# EAGLE schematic untitled (EAGLE 7.6.0)
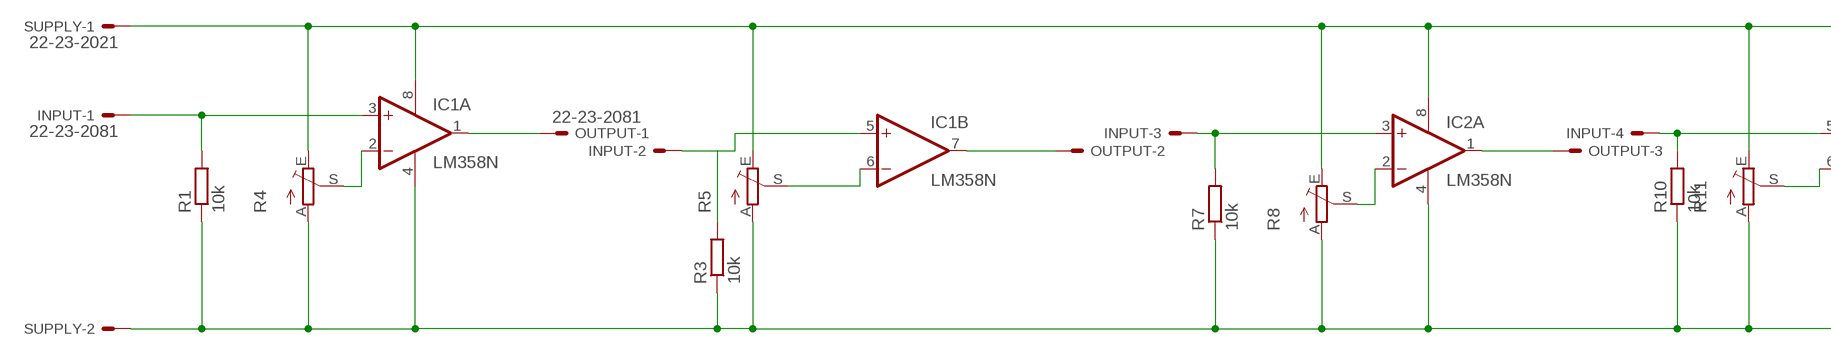
[diagram p0: schematic, sheet 1, part 1 of 2]
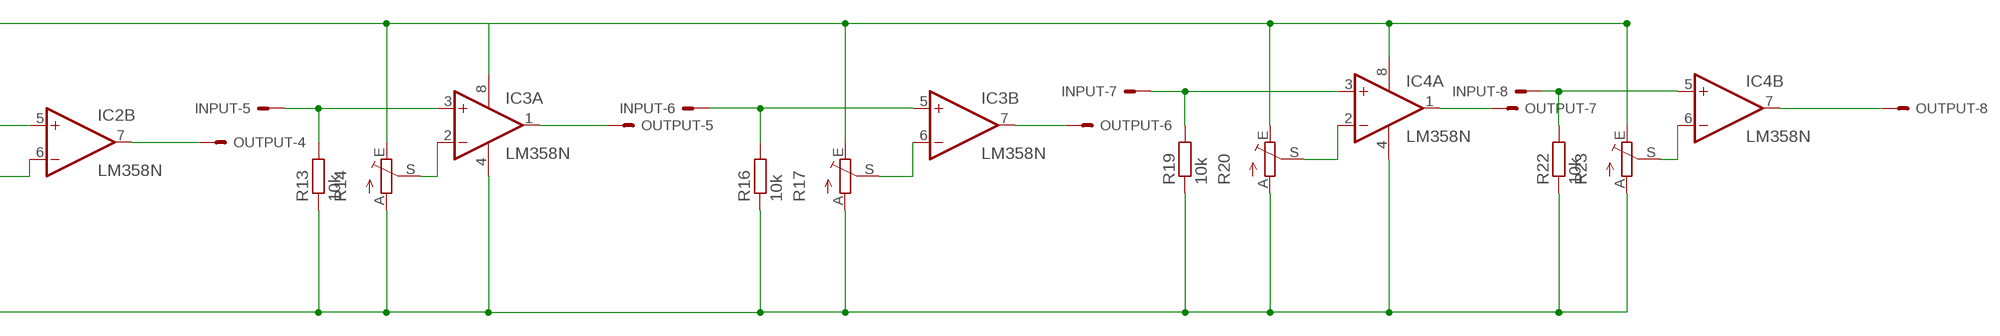
[diagram p1: schematic, sheet 1, part 2 of 2]

## Parts
IC1  LM358N  [DIL08]
IC2  LM358N  [DIL08]
IC3  LM358N  [DIL08]
IC4  LM358N  [DIL08]
INPUT  22-23-2081  [22-23-2081]
OUTPUT  22-23-2081  [22-23-2081]
R1  10k  R-EU_R1206  [R1206]
R3  10k  R-EU_R1206  [R1206]
R4  TRIM_EU-S64Y  [S64Y]
R5  TRIM_EU-S64Y  [S64Y]
R7  10k  R-EU_R1206  [R1206]
R8  TRIM_EU-S64Y  [S64Y]
R10  10k  R-EU_R1206  [R1206]
R11  TRIM_EU-S64Y  [S64Y]
R13  10k  R-EU_R1206  [R1206]
R14  TRIM_EU-S64Y  [S64Y]
R16  10k  R-EU_R1206  [R1206]
R17  TRIM_EU-S64Y  [S64Y]
R19  10k  R-EU_R1206  [R1206]
R20  TRIM_EU-S64Y  [S64Y]
R22  10k  R-EU_R1206  [R1206]
R23  TRIM_EU-S64Y  [S64Y]
SUPPLY  22-23-2021  [22-23-2021]

## Nets
N$1: IC1.3(A:+IN) INPUT.1 R1.2
N$2: IC1.2(A:-IN) R4.S
N$3: IC1.8(P:V+) IC2.8(P:V+) IC3.8(P:V+) IC4.8(P:V+) R4.E R5.E R8.E R11.E R14.E R17.E R20.E R23.E SUPPLY.1
N$4: IC1.4(P:V-) IC2.4(P:V-) R1.1 R3.1 R4.A R5.A R7.1 R8.A R10.1 R11.A SUPPLY.2
N$5: IC2.7(B:OUT) OUTPUT.4
N$6: IC1.1(A:OUT) OUTPUT.1
N$7: IC1.7(B:OUT) OUTPUT.2
N$8: IC3.4(P:V-) IC4.4(P:V-) R13.1 R14.A R16.1 R17.A R19.1 R20.A R22.1 R23.A
N$9: IC1.5(B:+IN) INPUT.2 R3.2
N$10: IC1.6(B:-IN) R5.S
N$11: IC2.3(A:+IN) INPUT.3 R7.2
N$12: IC2.2(A:-IN) R8.S
N$13: IC2.1(A:OUT) OUTPUT.3
N$15: IC3.2(A:-IN) R14.S
N$16: IC2.5(B:+IN) INPUT.4 R10.2
N$17: IC3.6(B:-IN) R17.S
N$18: IC3.7(B:OUT) OUTPUT.6
N$19: IC2.6(B:-IN) R11.S
N$23: IC4.6(B:-IN) R23.S
N$24: IC3.3(A:+IN) INPUT.5 R13.2
N$25: IC3.1(A:OUT) OUTPUT.5
N$28: IC3.5(B:+IN) INPUT.6 R16.2
N$31: IC4.2(A:-IN) R20.S
N$32: IC4.3(A:+IN) INPUT.7 R19.2
N$33: IC4.1(A:OUT) OUTPUT.7
N$36: IC4.5(B:+IN) INPUT.8 R22.2
N$38: IC4.7(B:OUT) OUTPUT.8

## Library data of the parts
IC1-IC4 = linear:LM358: OP AMP also LM158; LM258; LM2904 Source: http://cache.national.com/ds/LM/LM158.pdf
INPUT OUTPUT = con-molex:22-23-2081: .100" (2.54mm) Center Header - 8 Pin; MF: MOLEX; MPN: 22-23-2081; OC_FARNELL: 1756826; OC_NEWARK: 01C7592
R1 R3 R7 R10 R13 R16 R19 R22 = resistor:R-EU_: RESISTOR, European symbol
R4 R5 R8 R11 R14 R17 R20 R23 = pot:TRIM_EU-: POTENTIOMETER
SUPPLY = con-molex:22-23-2021: .100" (2.54mm) Center Header - 2 Pin; MF: MOLEX; MPN: 22-23-2021; OC_FARNELL: 1462926; OC_NEWARK: 25C3832